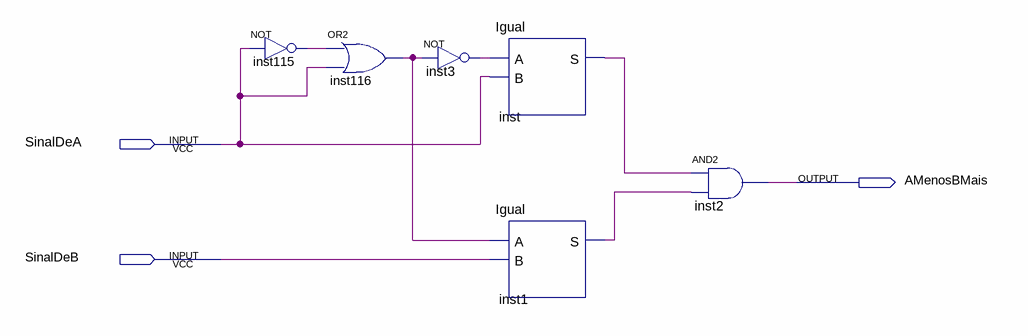
[diagram p0: schematic sheet]
// Quartus schematic AMenosBMais.bdf as structural Verilog: 6 symbols, 3 pins
module AMenosBMais (
  input  SinalDeA,
  input  SinalDeB,
  output AMenosBMais
);

  wire inst1_s, inst3_out, inst115_out, inst116_out, inst_s;

  not inst115 (inst115_out, SinalDeA);
  or inst116 (inst116_out, inst115_out, SinalDeA);
  not inst3 (inst3_out, inst116_out);
  Igual inst (.A(inst3_out), .B(SinalDeA), .S(inst_s));
  Igual inst1 (.A(inst116_out), .B(SinalDeB), .S(inst1_s));
  and inst2 (AMenosBMais, inst_s, inst1_s);
endmodule
